# Altium schematic sheet Extension connector.SCHDOC: Extension connector
size A3; DocumentNumber: MB1144; Revision: C-02; SheetNumber: 12; SheetTotal: 25; Project: STM32L476G-EVAL; ModifiedDate: 9/23/2015
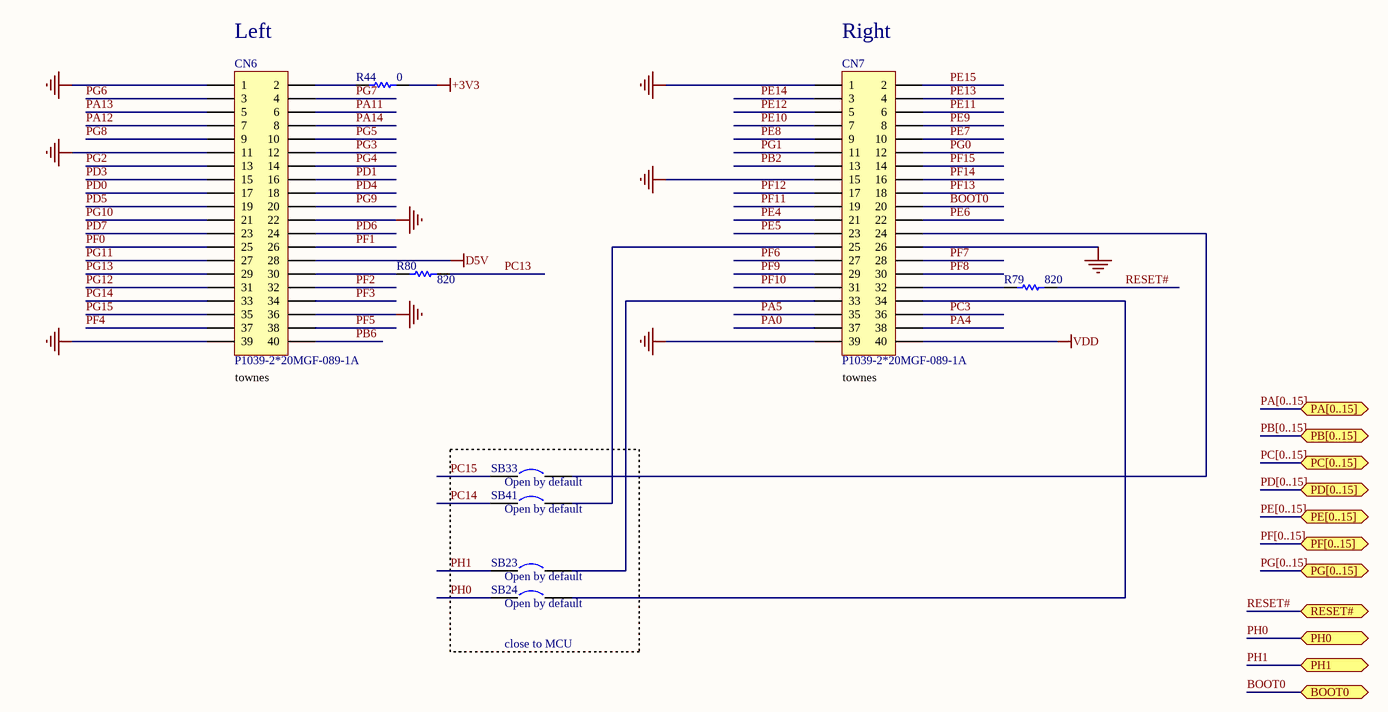
[diagram p0: Extension connector.SCHDOC]

## Parts
CN6  P1039-2*20MGF-089-1A  [FTR-120-53-L-D-LC]
CN7  P1039-2*20MGF-089-1A  [FTR-120-53-L-D-LC]
R44  0  [0603R]
R79  820  [0402R]
R80  820  [0402R]
SB23  Open by default  [SB_0603]
SB24  Open by default  [SB_0603]
SB33  Open by default  [SB_0603]
SB41  Open by default  [SB_0603]

## Blocks framed on the sheet
close to MCU: SB23 SB24 SB33 SB41

## Ports
BOOT0, PA[0..15] (bidir), PB[0..15] (bidir), PC[0..15] (bidir), PD[0..15] (bidir), PE[0..15] (bidir), PF[0..15] (bidir), PG[0..15] (bidir), PH0, PH1, RESET# (bidir)

## Nets
+3V3: R44.1
D5V: CN6.28
GND: CN6.1 CN6.11 CN6.22 CN6.36 CN6.39 CN7.1 CN7.15 CN7.26 CN7.39
VDD: CN7.40
BOOT0: CN7.20 ; port BOOT0
PA0: CN7.37
PA4: CN7.38
PA5: CN7.35
PA11: CN6.6
PA12: CN6.7
PA13: CN6.5
PA14: CN6.8
PB2: CN7.13
PB6: CN6.40
PC3: CN7.36
PC13: R80.2
PC14: SB41.1
PC15: SB33.1
PD0: CN6.17
PD1: CN6.16
PD3: CN6.15
PD4: CN6.18
PD5: CN6.19
PD6: CN6.24
PD7: CN6.23
PE4: CN7.21
PE5: CN7.23
PE6: CN7.22
PE7: CN7.10
PE8: CN7.9
PE9: CN7.8
PE10: CN7.7
PE11: CN7.6
PE12: CN7.5
PE13: CN7.4
PE14: CN7.3
PE15: CN7.2
PF0: CN6.25
PF1: CN6.26
PF2: CN6.32
PF3: CN6.34
PF4: CN6.37
PF5: CN6.38
PF6: CN7.27
PF7: CN7.28
PF8: CN7.30
PF9: CN7.29
PF10: CN7.31
PF11: CN7.19
PF12: CN7.17
PF13: CN7.18
PF14: CN7.16
PF15: CN7.14
PG0: CN7.12
PG1: CN7.11
PG2: CN6.13
PG3: CN6.12
PG4: CN6.14
PG5: CN6.10
PG6: CN6.3
PG7: CN6.4
PG8: CN6.9
PG9: CN6.20
PG10: CN6.21
PG11: CN6.27
PG12: CN6.31
PG13: CN6.29
PG14: CN6.33
PG15: CN6.35
PH0: SB24.1 ; port PH0
PH1: SB23.1 ; port PH1
RESET#: R79.1 ; port RESET#
NetCN6_2: CN6.2 R44.2
NetCN6_30: CN6.30 R80.1
NetCN7_24: CN7.24 SB33.2
NetCN7_25: CN7.25 SB41.2
NetCN7_32: CN7.32 R79.2
NetCN7_33: CN7.33 SB23.2
NetCN7_34: CN7.34 SB24.2

## Buses and harness runs
bus PA[0..15] = port PA[0..15]
bus PB[0..15] = port PB[0..15]
bus PC[0..15] = port PC[0..15]
bus PD[0..15] = port PD[0..15]
bus PE[0..15] = port PE[0..15]
bus PF[0..15] = port PF[0..15]
bus PG[0..15] = port PG[0..15]

## Notes on the sheet
- (near CN6) Left
- (near CN7) Right
- (near CN6) townes
- (near CN7) townes
- Title:
- Project:
- Size:
- Date:
- A3
- Reference:
- Sheet:
- Revision:
- of

## Library data of the parts
CN6 CN7 = FTR-120-53-L-D-LC: Header, 20-Pin, Dual row; Ordered by: Subcon; Comments: extension connector; ECCN_US/EU: NA; Revision: 17-Jul-2002: Re-released for DXP Platform.; Publisher: Altium Limited; Samtec components: FTR-120-53-L-D-LC
R44 R79 R80 = Res1: Resistor; Value: 1K; Ordered by: Subcon; ECCN_US/EU: NA; Published: 8-Jun-2000; Revision: July-2002: Re-released for DXP Platform.; Publisher: Altium Limited
SB23 SB24 SB33 SB41 = Circuit Breaker: Ordered by: Subcon; Comments: Solder bridge; Fitted: NO; ECCN_US/EU: NA; Published: 24-Mar-1999; Revision: July-2002: Re-released for DXP Platform.; Publisher: Altium Limited